# EAGLE design capstone (EAGLE 9.5.2)

## Sheet 1 of 6: Block Diagram

## Sheet 2 of 6: Teensy 3.2 Connection
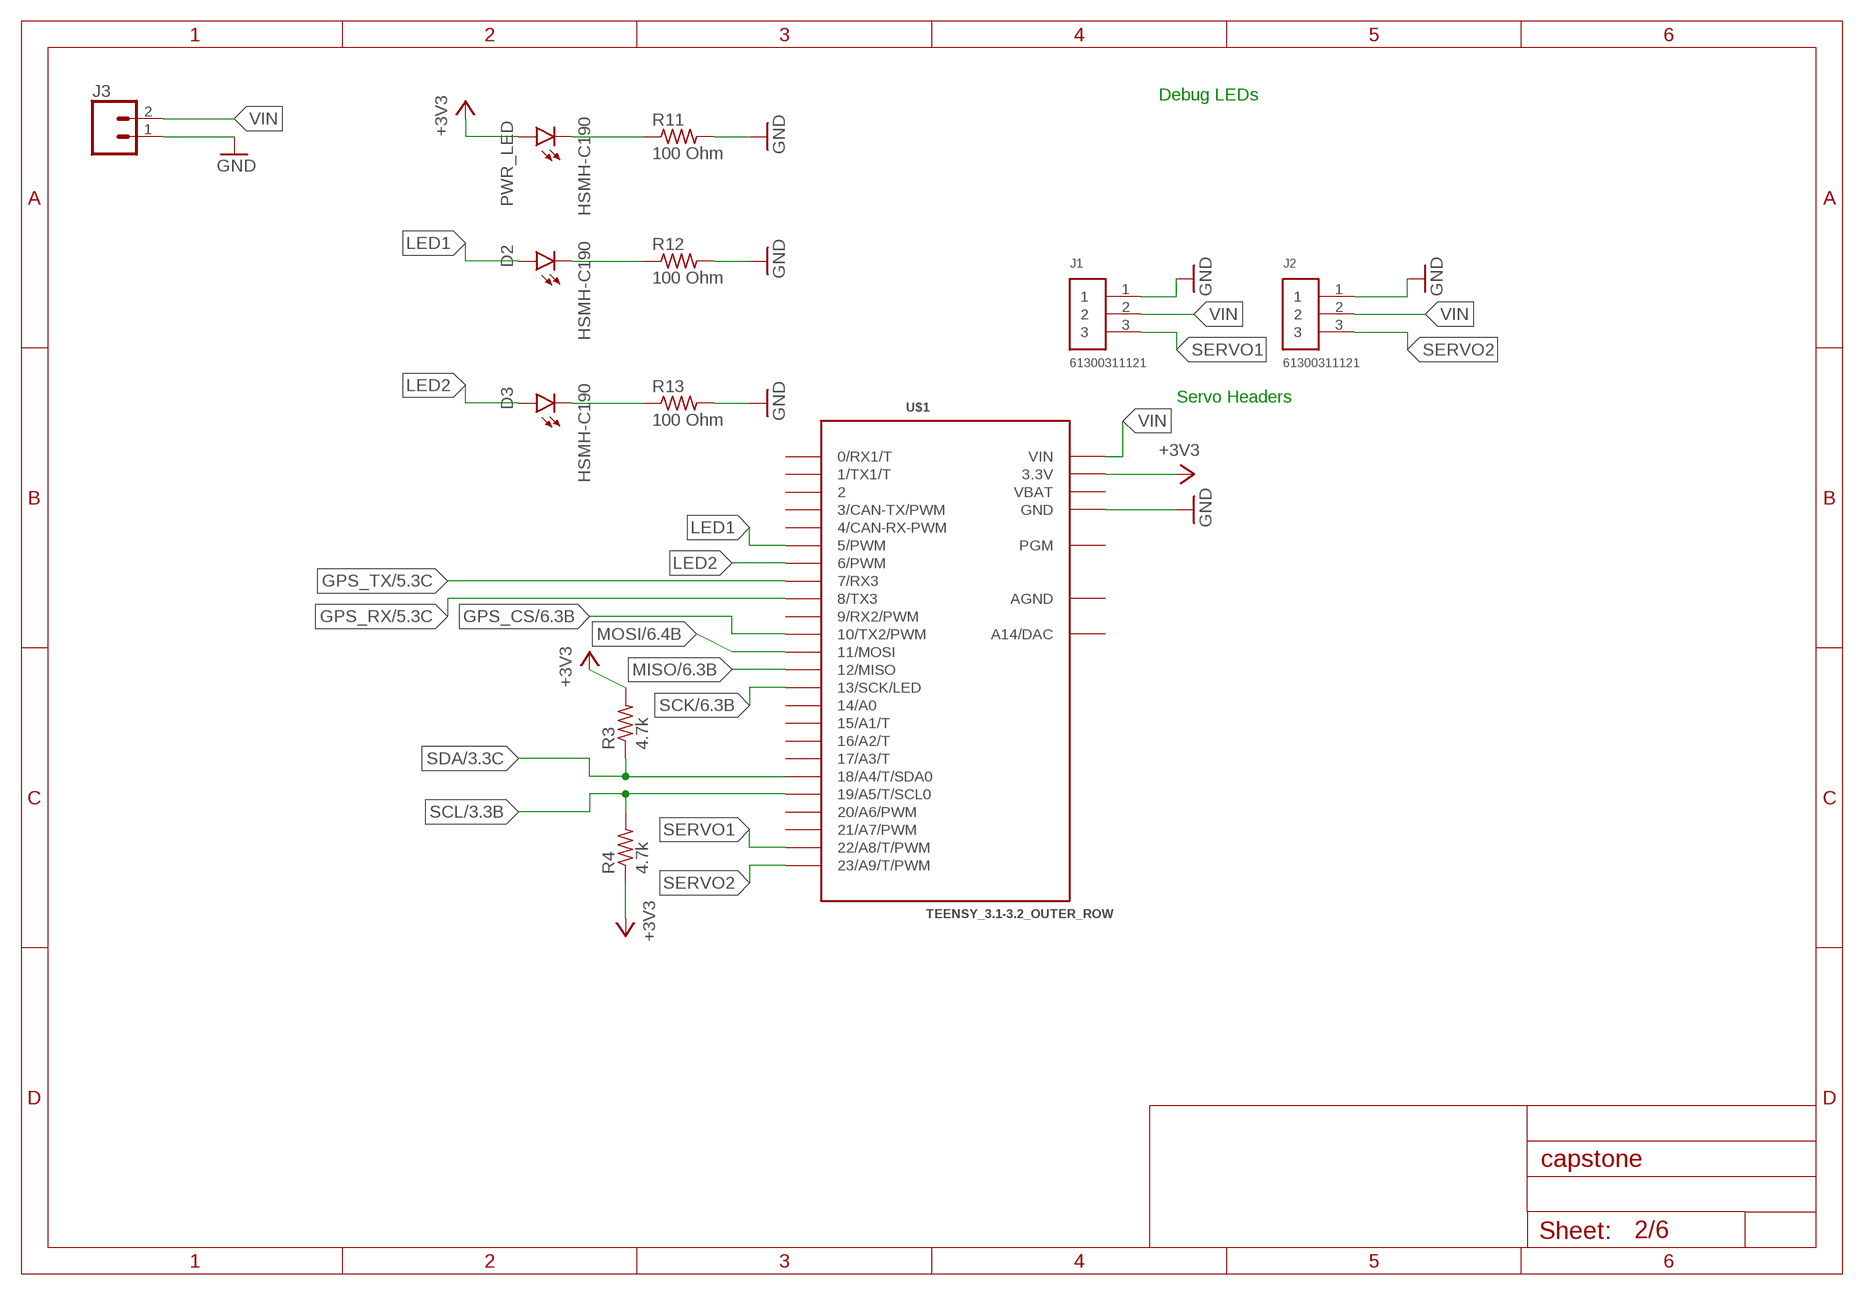
[diagram p0: schematic, sheet 2]

### Parts
D2  HSMH-C190  [LED-0603]
D3  HSMH-C190  [LED-0603]
J1  61300311121  [61300311121]
J2  61300311121  [61300311121]
J3  CONN_02  [1X02]
PWR_LED  HSMH-C190  [LED-0603]
R3  4.7k  R-US_R0603  [R0603]
R4  4.7k  R-US_R0603  [R0603]
R11  100 Ohm  R-US_R0603  [R0603]
R12  100 Ohm  R-US_R0603  [R0603]
R13  100 Ohm  R-US_R0603  [R0603]
U$1  TEENSY_3.1-3.2_OUTER_ROW  [TEENSY_3.0-3.2&LC_OUTER_ROW]

### Nets
+3V3: PWR_LED.A R3.2 R4.1 U$1.3.3V U$1.3.3V1(3.3V) ; also sheet 3,4,5,6
GND: J1.1 J2.1 J3.1 R11.2 R12.2 R13.2 U$1.GND U$1.GND1(GND) ; also sheet 3,4,5,6
GPS_CS: U$1.10(10/TX2/PWM) ; also sheet 6
GPS_RX: U$1.8(8/TX3) ; also sheet 5
GPS_TX: U$1.7(7/RX3) ; also sheet 5
LED1: D2.A U$1.5(5/PWM)
LED2: D3.A U$1.6(6/PWM)
MISO: U$1.12(12/MISO) ; also sheet 6
MOSI: U$1.11(11/MOSI) ; also sheet 6
N$5: PWR_LED.C R11.1
N$6: D2.C R12.1
N$7: D3.C R13.1
SCK: U$1.13(13/SCK/LED) ; also sheet 6
SCL: R4.2 U$1.19/A5(19/A5/T/SCL0) ; also sheet 3,4
SDA: R3.1 U$1.18/A4(18/A4/T/SDA0) ; also sheet 3,4
SERVO1: J1.3 U$1.22/A8(22/A8/T/PWM)
SERVO2: J2.3 U$1.23/A9(23/A9/T/PWM)
VIN: J1.2 J2.2 J3.2 U$1.VIN
Unconnected: U$1.0(0/RX1/T) U$1.1(1/TX1/T) U$1.2 U$1.3(3/CAN-TX/PWM) U$1.4(4/CAN-RX-PWM) U$1.9(9/RX2/PWM) U$1.14/A0 U$1.15/A1(15/A1/T) U$1.16/A2(16/A2/T) U$1.17/A3(17/A3/T) U$1.20/A6(20/A6/PWM) U$1.21/A7(21/A7/PWM) U$1.PGM U$1.RESET/DAC(A14/DAC)

### Notes on the sheet
- Debug LEDs
- Servo Headers

## Sheet 3 of 6: BMP-388 Connection
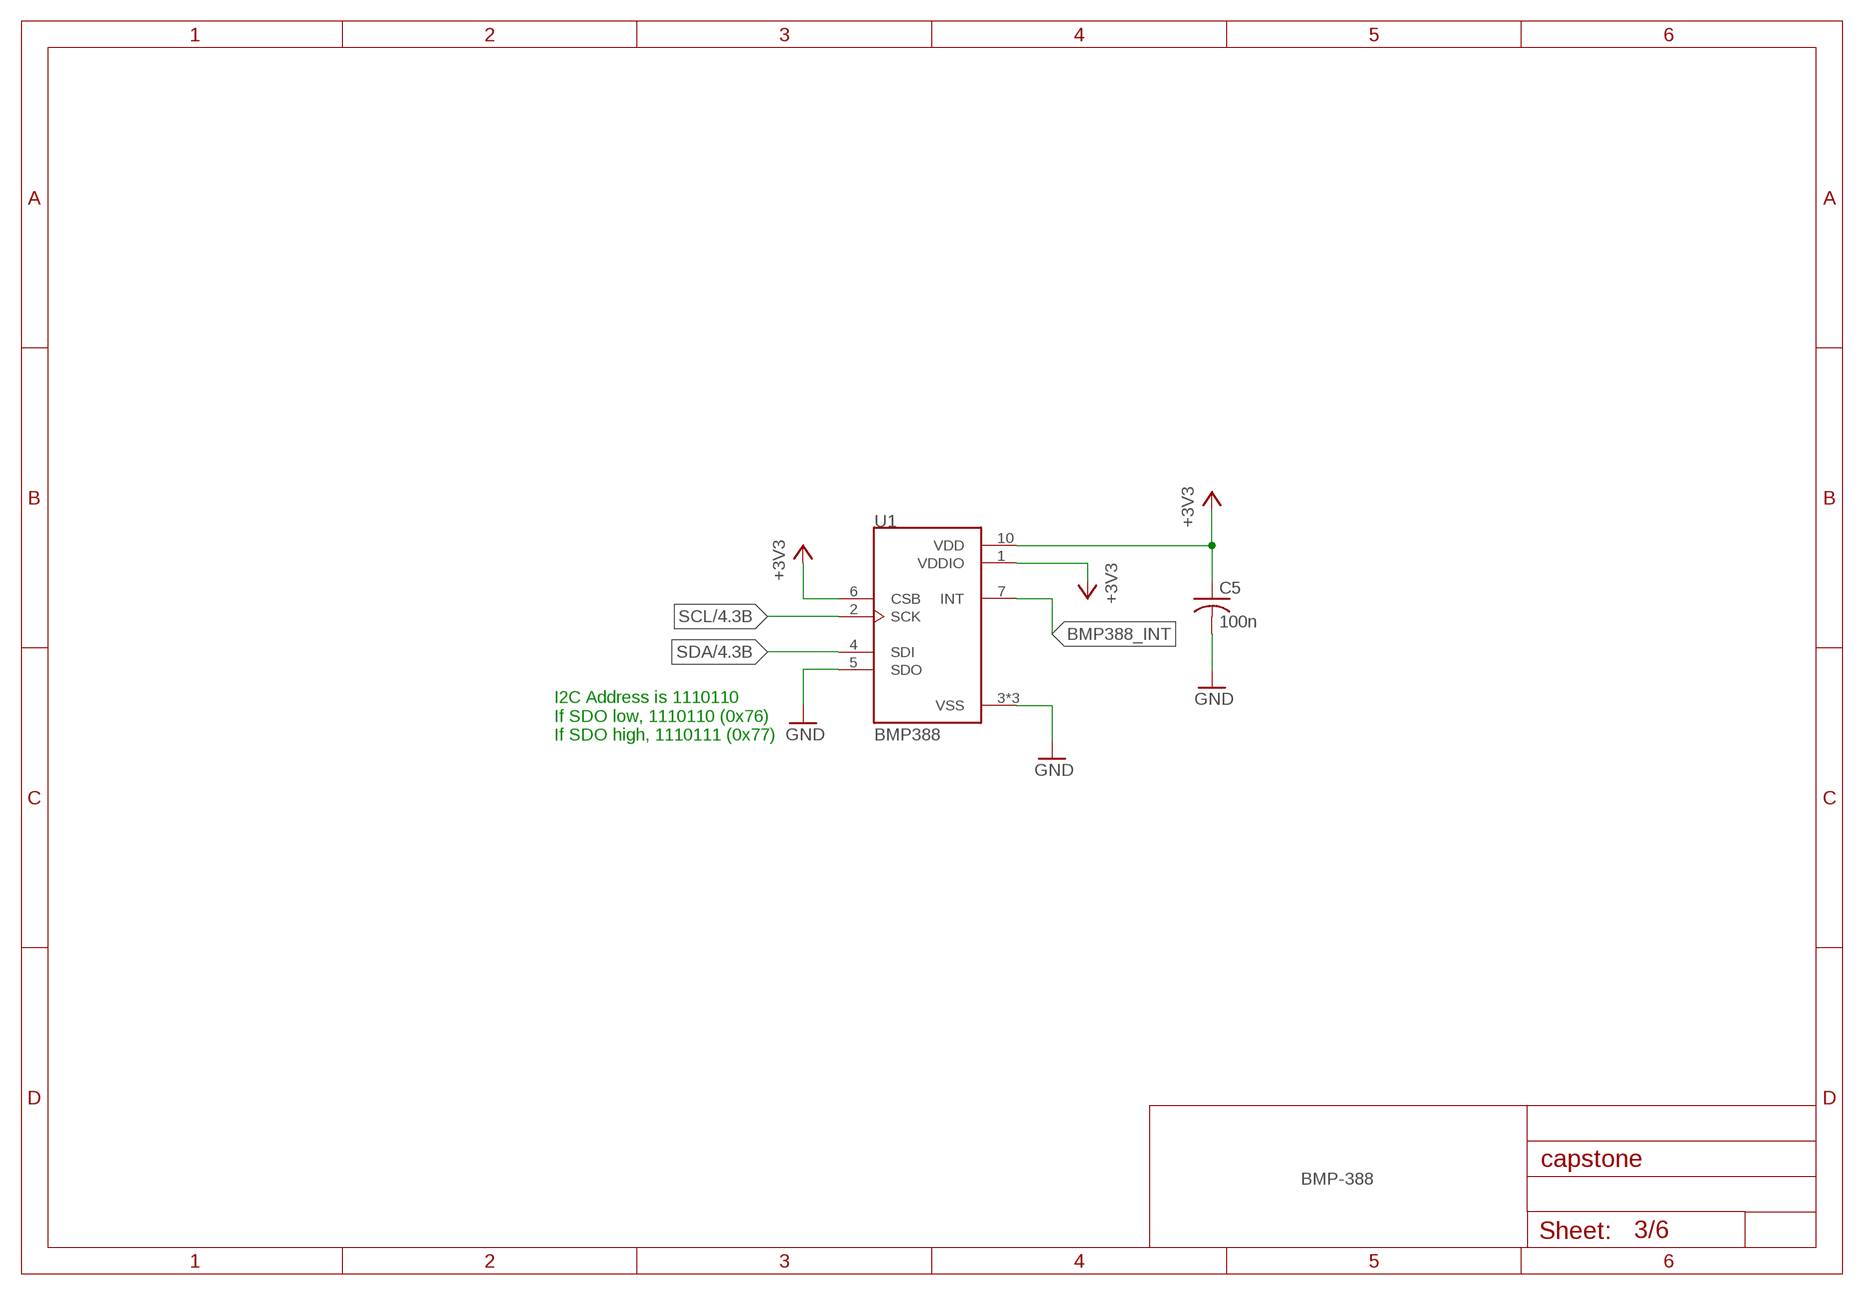
[diagram p1: schematic, sheet 3]

### Parts
C5  100n  C-USC0603  [C0603]
U1  BMP388  [PQFN50P200X200X80-10N]

### Nets
+3V3: C5.1 U1.1(VDDIO) U1.6(CSB) U1.10(VDD) ; also sheet 2,4,5,6
BMP388_INT: U1.7(INT)
GND: C5.2 U1.3(VSS) U1.5(SDO) U1.8(VSS) U1.9(VSS) ; also sheet 2,4,5,6
SCL: U1.2(SCK) ; also sheet 2,4
SDA: U1.4(SDI) ; also sheet 2,4

### Notes on the sheet
- I2C Address is 1110110
  If SDO low, 1110110 (0x76)
  If SDO high, 1110111 (0x77)
- BMP-388

## Sheet 4 of 6: LSM9DS1 Connection
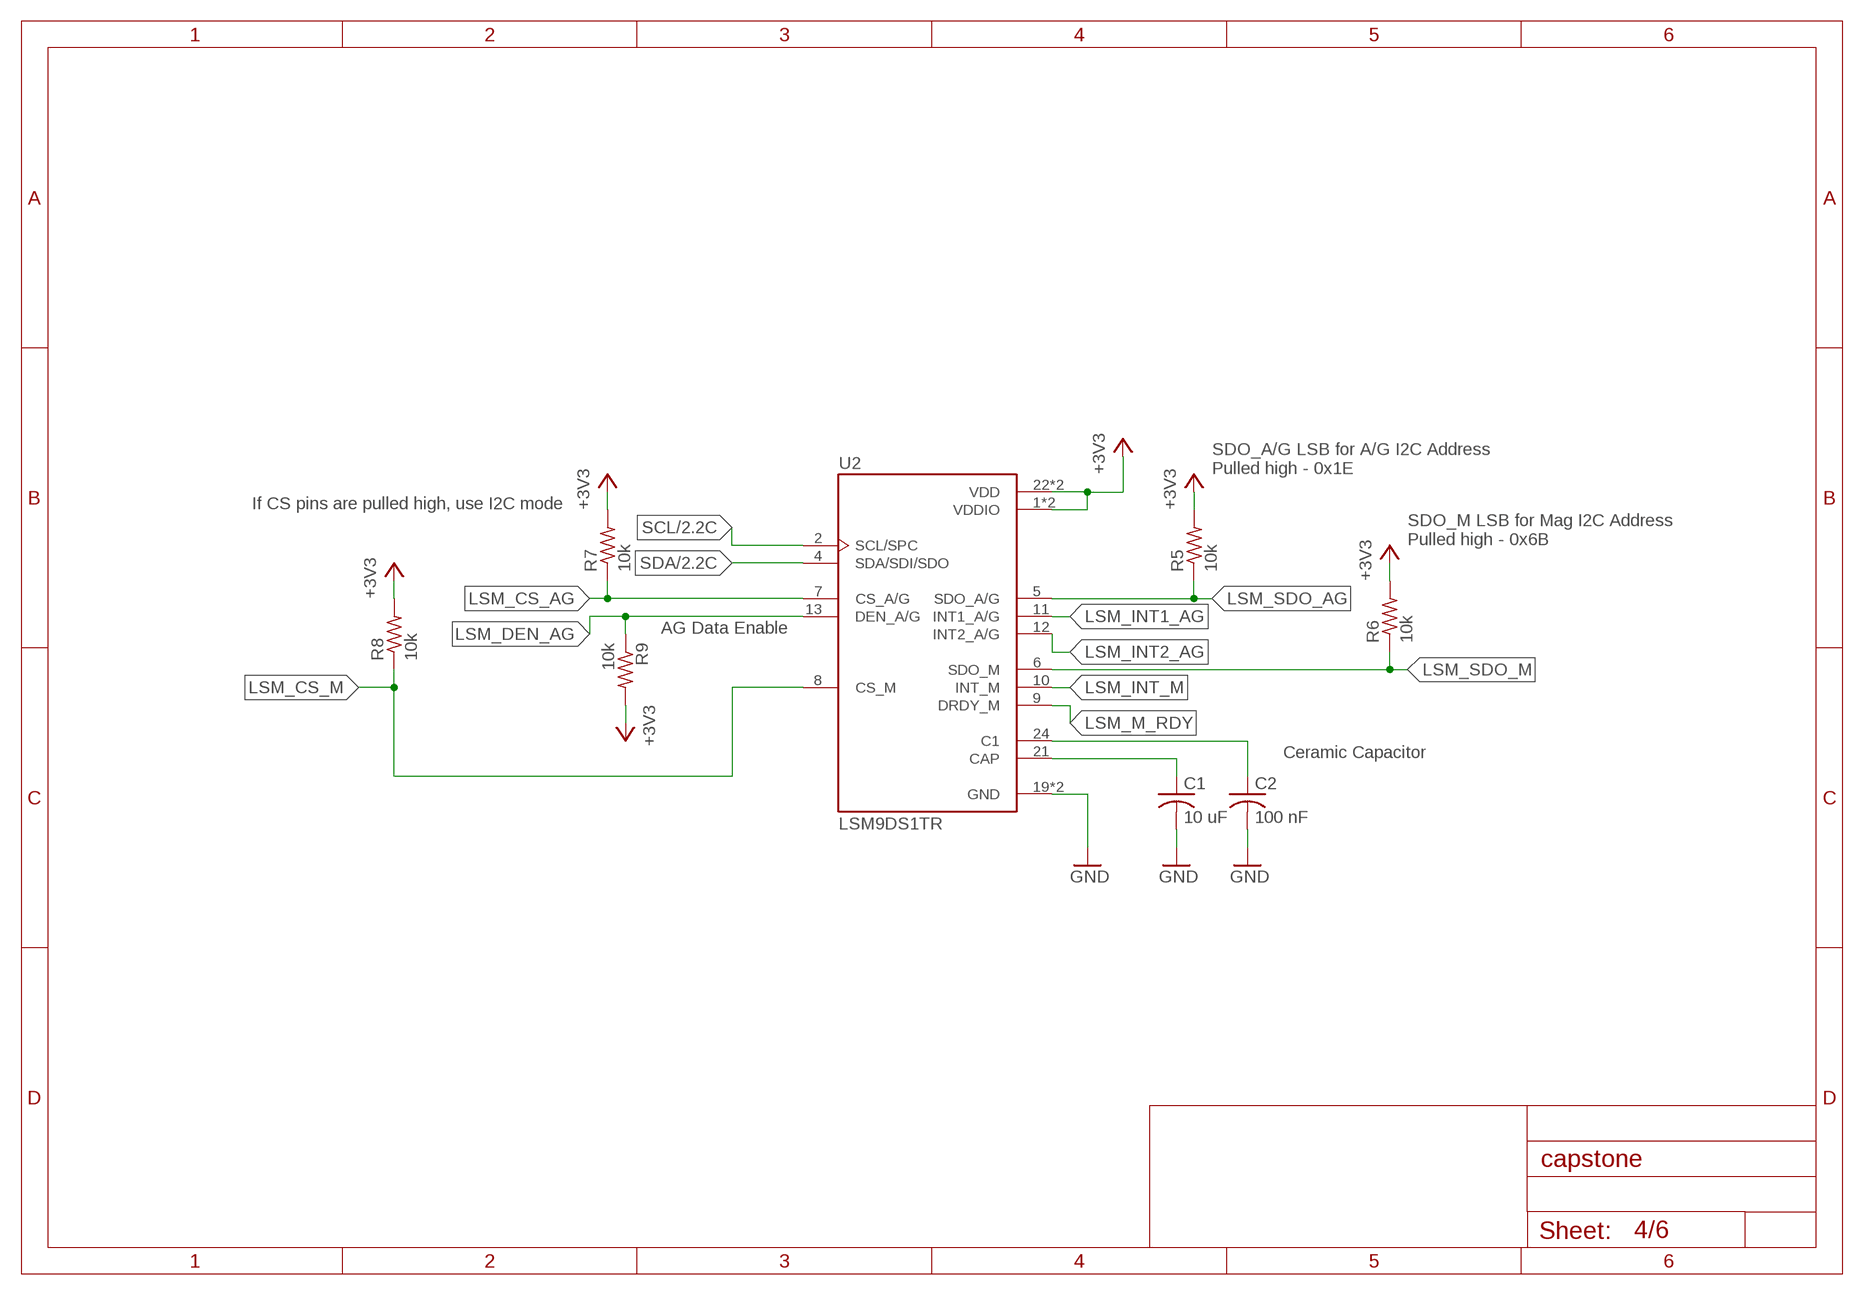
[diagram p2: schematic, sheet 4]

### Parts
C1  10 uF  C-USC0603  [C0603]
C2  100 nF  C-USC0603  [C0603]
R5  10k  R-US_R0603  [R0603]
R6  10k  R-US_R0603  [R0603]
R7  10k  R-US_R0603  [R0603]
R8  10k  R-US_R0603  [R0603]
R9  10k  R-US_R0603  [R0603]
U2  LSM9DS1TR  [PQFN43P300X350X102-24N]

### Nets
+3V3: R5.2 R6.2 R7.2 R8.2 R9.2 U2.1(VDDIO) U2.3(VDDIO) U2.22(VDD) U2.23(VDD) ; also sheet 2,3,5,6
GND: C1.2 C2.2 U2.19(GND) U2.20(GND) ; also sheet 2,3,5,6
LSM_CS_AG: R7.1 U2.7(CS_A/G)
LSM_CS_M: R8.1 U2.8(CS_M)
LSM_DEN_AG: R9.1 U2.13(DEN_A/G)
LSM_INT1_AG: U2.11(INT1_A/G)
LSM_INT2_AG: U2.12(INT2_A/G)
LSM_INT_M: U2.10(INT_M)
LSM_M_RDY: U2.9(DRDY_M)
LSM_SDO_AG: R5.1 U2.5(SDO_A/G)
LSM_SDO_M: R6.1 U2.6(SDO_M)
N$1: C1.1 U2.21(CAP)
N$2: C2.1 U2.24(C1)
SCL: U2.2(SCL/SPC) ; also sheet 2,3
SDA: U2.4(SDA/SDI/SDO) ; also sheet 2,3

### Notes on the sheet
- SDO_A/G LSB for A/G I2C Address
  Pulled high - 0x1E
- If CS pins are pulled high, use I2C mode
- SDO_M LSB for Mag I2C Address
  Pulled high - 0x6B
- AG Data Enable
- Ceramic Capacitor

## Sheet 5 of 6: MTK3399 Connection
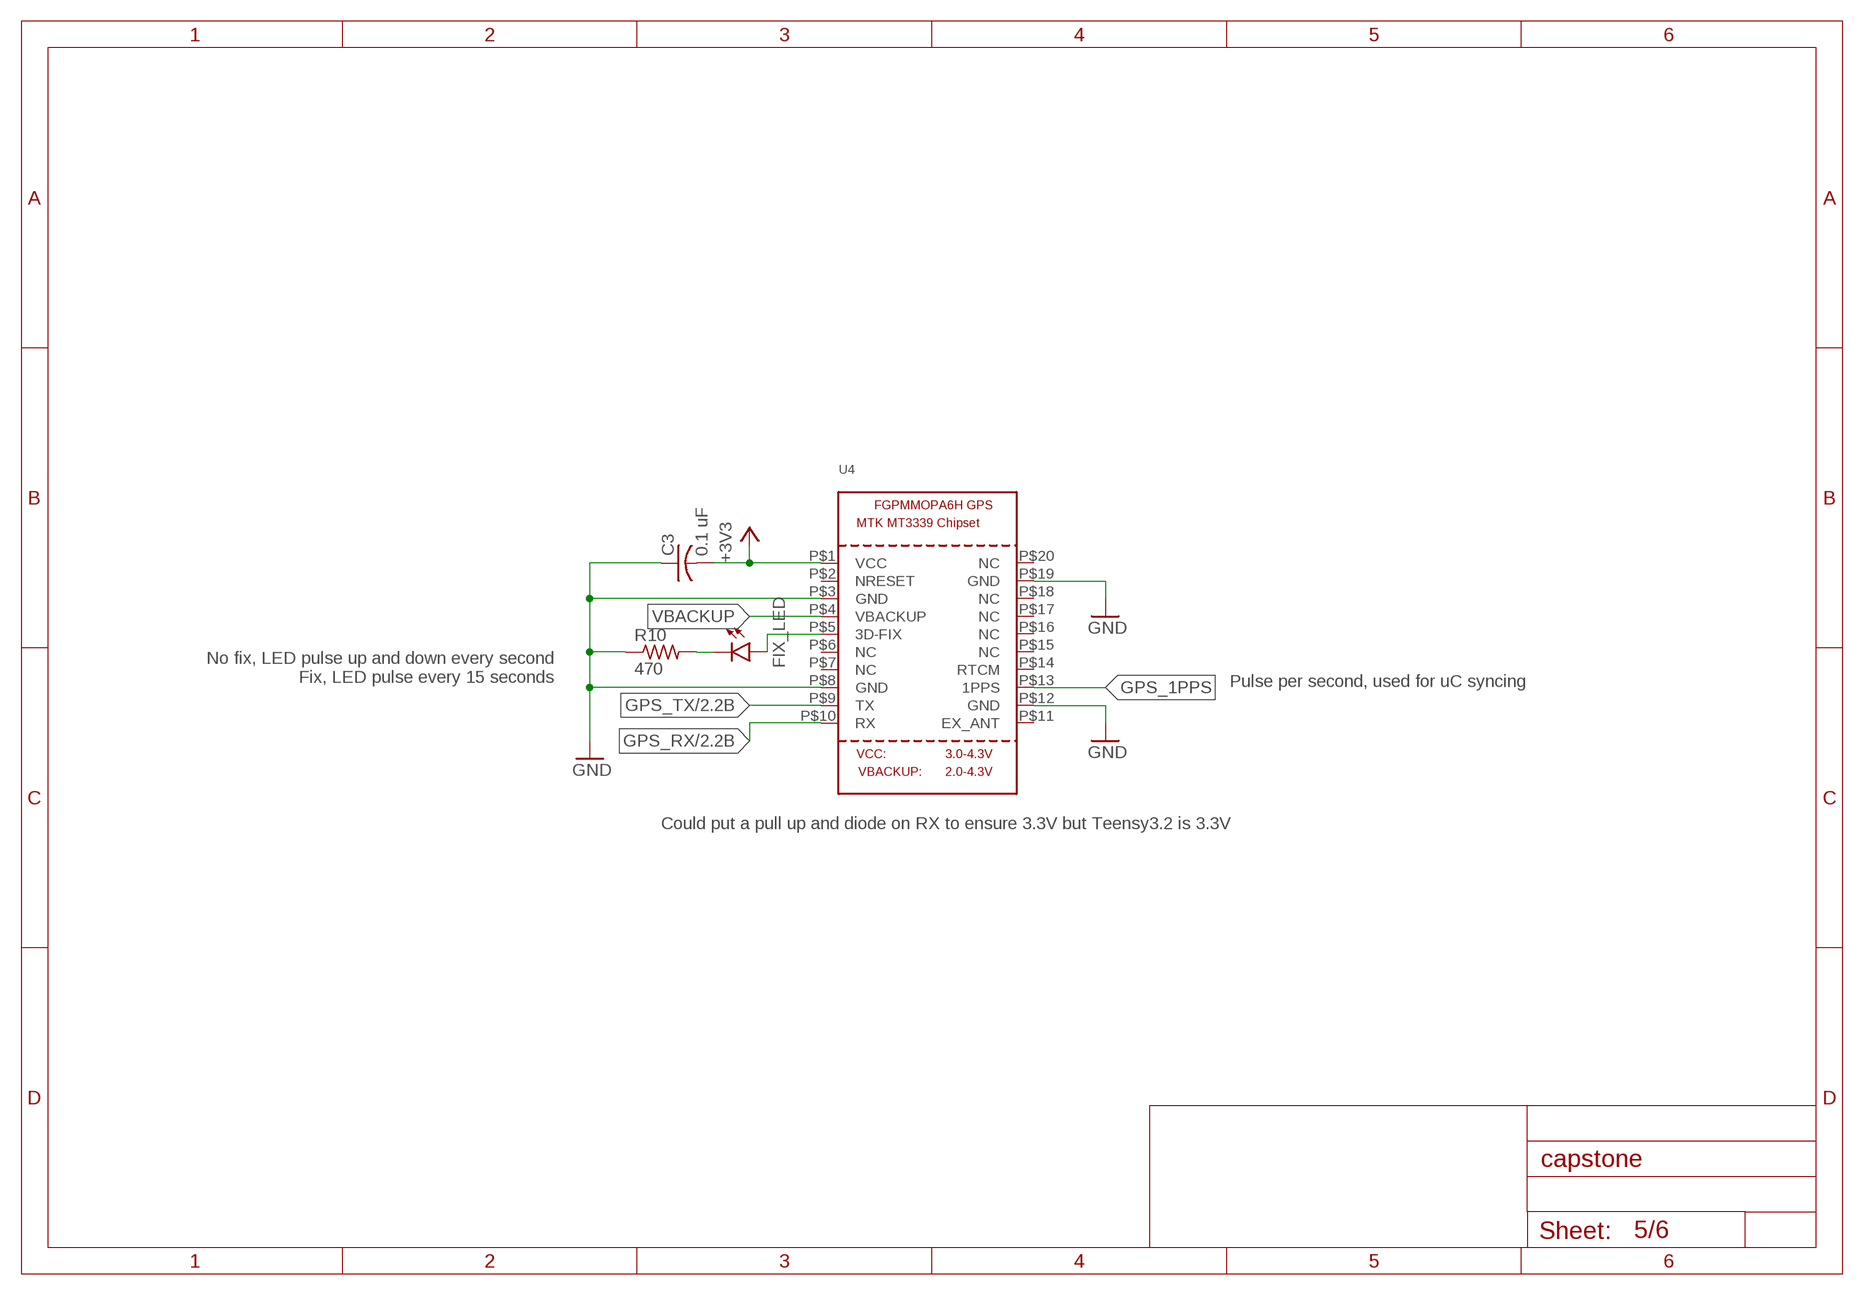
[diagram p3: schematic, sheet 5]

### Parts
C3  0.1 uF  C-USC0603  [C0603]
FIX_LED  HSMH-C190  [LED-0603]
R10  470  R-US_R0603  [R0603]
U4  GPS_FGPMMOPA6H  [FGPMMOPA6H]

### Nets
+3V3: C3.2 U4.P$1(VCC) ; also sheet 2,3,4,6
GND: C3.1 R10.1 U4.P$3(GND) U4.P$8(GND) U4.P$12(GND) U4.P$19(GND) ; also sheet 2,3,4,6
GPS_1PPS: U4.P$13(1PPS)
GPS_RX: U4.P$10(RX) ; also sheet 2
GPS_TX: U4.P$9(TX) ; also sheet 2
N$3: FIX_LED.C R10.2
N$4: FIX_LED.A U4.P$5(3D-FIX)
VBACKUP: U4.P$4(VBACKUP)
Unconnected: U4.P$2(NRESET) U4.P$6(NC) U4.P$7(NC) U4.P$11(EX_ANT) U4.P$14(RTCM) U4.P$15(NC) U4.P$16(NC) U4.P$17(NC) U4.P$18(NC) U4.P$20(NC)

### Notes on the sheet
- No fix, LED pulse up and down every second
  Fix, LED pulse every 15 seconds
- Pulse per second, used for uC syncing
- Could put a pull up and diode on RX to ensure 3.3V but Teensy3.2 is 3.3V

## Sheet 6 of 6: RFM95W Connection
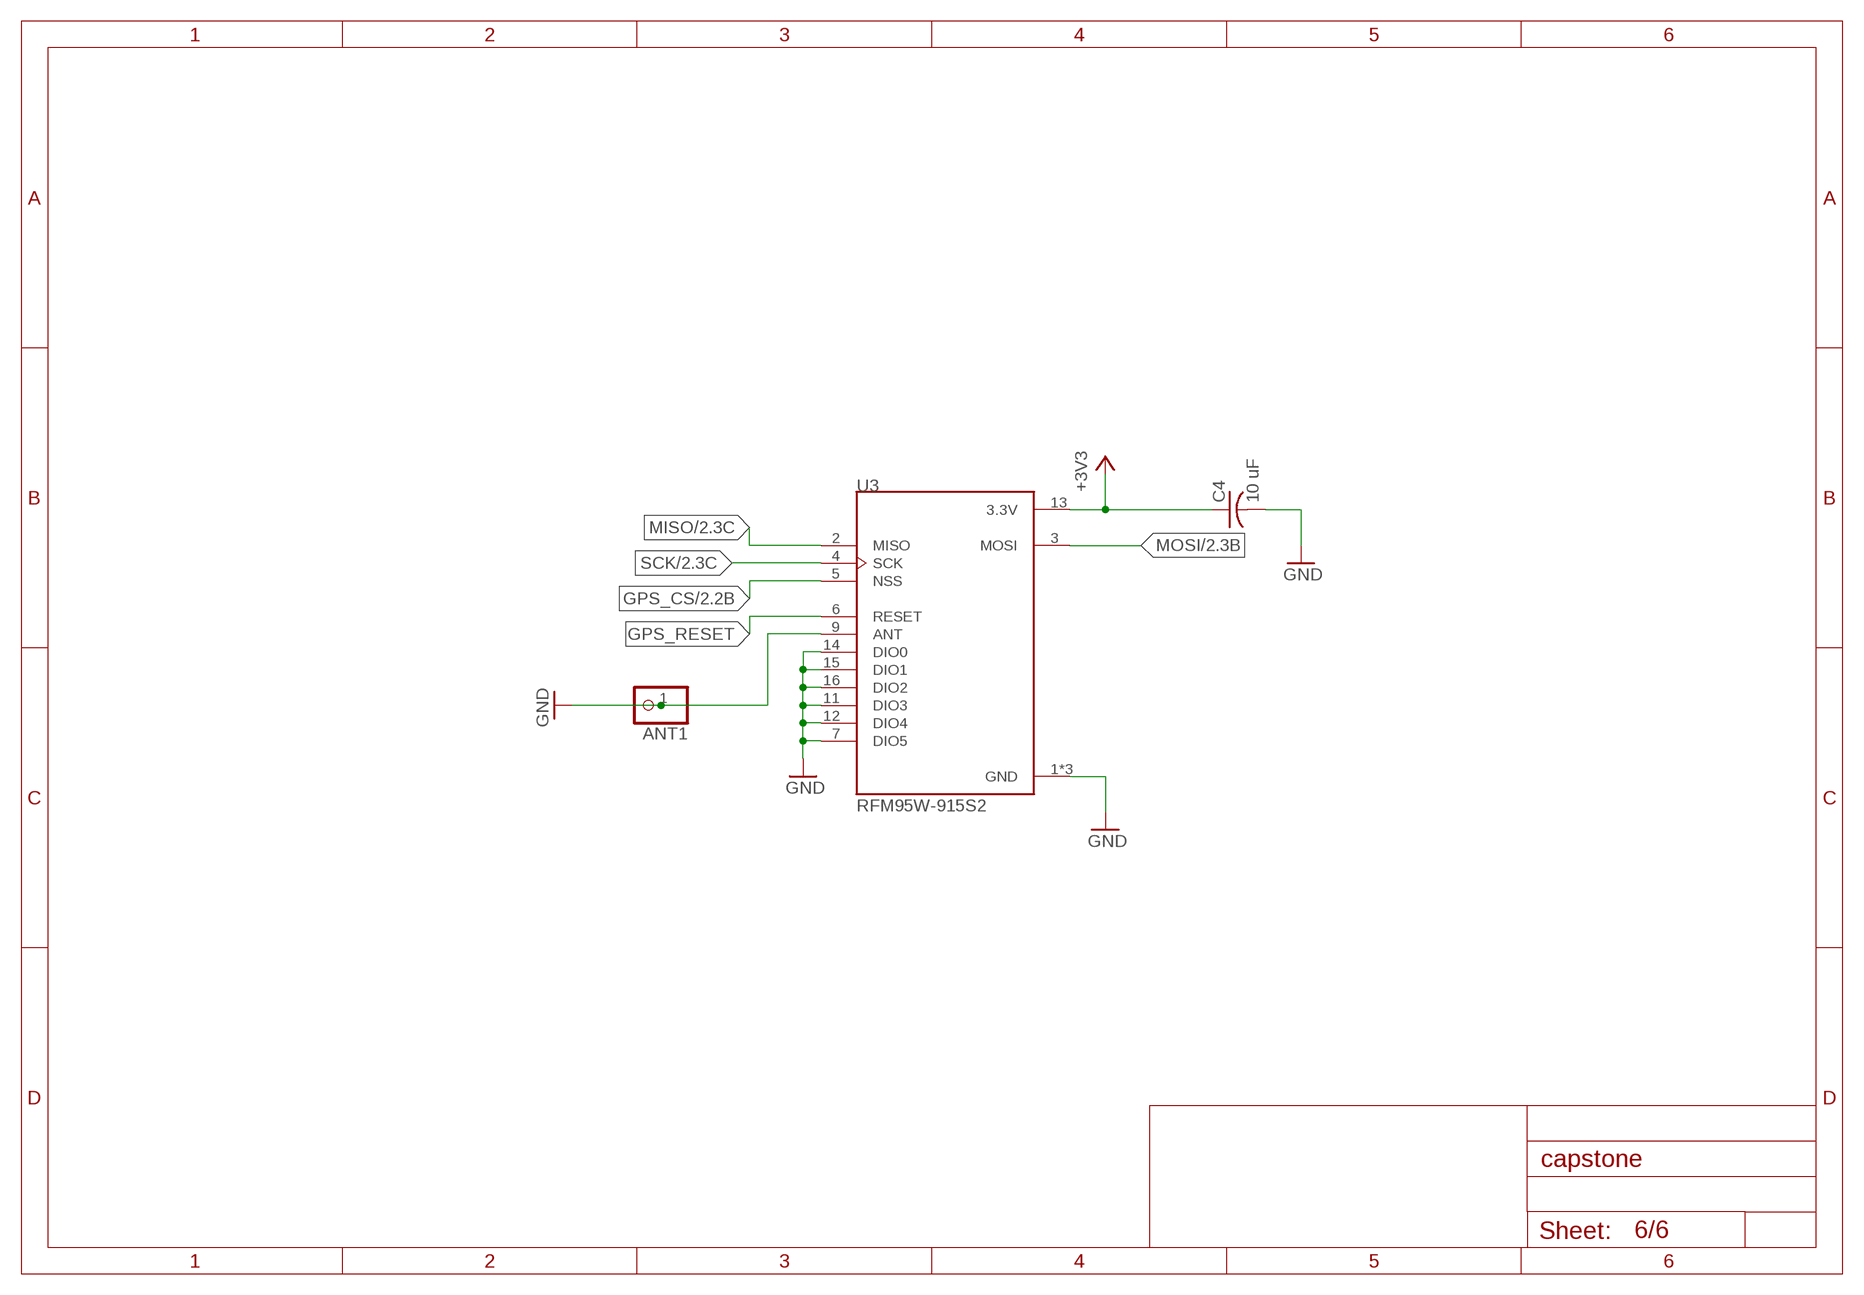
[diagram p4: schematic, sheet 6]

### Parts
ANT1  PINHD-1X1  [1X01]
C4  10 uF  C-USC0603  [C0603]
U3  RFM95W-915S2  [XCVR_RFM95W-915S2]

### Nets
+3V3: C4.1 U3.13(3.3V) ; also sheet 2,3,4,5
GND: ANT1.1 C4.2 U3.1(GND) U3.7(DIO5) U3.8(GND) U3.9(ANT) U3.10(GND) U3.11(DIO3) U3.12(DIO4) U3.14(DIO0) U3.15(DIO1) U3.16(DIO2) ; also sheet 2,3,4,5
GPS_CS: U3.5(NSS) ; also sheet 2
GPS_RESET: U3.6(RESET)
MISO: U3.2(MISO) ; also sheet 2
MOSI: U3.3(MOSI) ; also sheet 2
SCK: U3.4(SCK) ; also sheet 2

## Power pins joined to a net without a drawn wire
AGND: U$1.AGND
VBAT: U$1.VBAT

## Library data of the parts
ANT1 = adafruit:PINHD-1X1: Pin header 1x1 for 0.1" spacing With round pins
C1-C4 = resistor:C-US: CAPACITOR, American symbol
C5 = rcl:C-US: CAPACITOR, American symbol; SPICEPREFIX: C
D2 D3 FIX_LED PWR_LED = LED:HSMH-C190: LED RED DIFFUSED CHIP SMD Manufacturer's datasheet <https://media.digikey.com/pdf/Data%20Sheets/Avago%20PDFs/HSMz-Czzz.pdf>; CREATED_BY: PCBLayout.com; DIGIKEY_PART_NUMBER: 516-1420-1-ND; MANUFACTURER: Broadcom Limited; MPN: HSMH-C190; PACKAGE: 0603
J1 J2 = Headers:61300311121: CONN HEADER VERT 3POS 2.54MM Manufacturer's datasheet <https://katalog.we-online.de/em/datasheet/6130xx11121.pdf>; CREATED_BY: PCBLayout.com; DIGI_KEY_PART_NUMBER: 732-5316-ND; MANUFACTURER: Wurth Electronics Inc.; MPN: 61300311121
J3 = SparkFun-Connectors:CONN_02: Multi connection point. Often used as Generic Header-pin footprint for 0.1 inch spaced/style header connections On any of the 0.1 inch spaced packages, you can populate with these: Break Away Headers - Straight <https://www.sparkfun.com/products/116> (PRT-00116) Break Away Male Headers - Right Angle <https://www.sparkfun.com/products/553> (PRT-00553) Female Headers <https://www.sparkfun.com/products/115> (PRT-00115) Break Away Headers - Machine Pin <https://www.sparkfun.com/products/117> (PRT-00117) Break Away Female Headers - Swiss Machine Pin <https://www.sparkfun.com/products/743> (PRT-00743) For SCREWTERMINALS and SPRING TERMINALS visit here: Screw Terimnals on SparkFun.com <https://www.sparkfun.com/search/results?term=Screw+Terminals> (5mm/3.5mm/2.54mm spacing) This device is also useful as a general connection point to wire up your design to another part of your project. Our various solder wires solder well into these plated through hole pads. Hook-Up Wire - Assortment (Stranded, 22 AWG) <https://www.sparkfun.com/products/11375> (PRT-11375) Hook-Up Wire - Assortment (Solid Core, 22 AWG) <https://www.sparkfun.com/products/11367> (PRT-11367) View the entire wire category on our website here <https://www.sparkfun.com/categories/141> Special notes: Molex polarized connector foot print use with: PRT-08233 with associated crimp pins and housings. 2.54_SCREWTERM for use with PRT-10571. 3.5mm Screw Terminal footprints for PRT-08084 5mm Screw Terminal footprints for use with PRT-08432
R3-R13 = resistor:R-US_: RESISTOR, American symbol
U1 = BMP388:BMP388: P-Sensor SPI I2C 1, 25 Bar SMD; DESCRIPTION: P-Sensor SPI I2C 1, 25 Bar SMD; DIGI-KEY_PART_NUMBER: 828-1079-1-ND; DIGI-KEY_PURCHASE_URL: https://www.digikey.ca/product-detail/en/bosch-sensortec/BMP388/828-1079-1-ND/8322640?utm_source=snapeda&utm_medium=aggregator&utm_campaign=symbol; MF: Bosch Sensortec; MP: BMP388; PACKAGE: WFLGA-10 Bosch Tools
U2 = LSM9DS1TR:LSM9DS1TR: The LSM9DS1 is a system-in-package featuring a 3D digital linear acceleration sensor, a 3D digital angular rate sensor, and a 3D digital magnetic sensor.; DESCRIPTION: LSM9DS1 Series ±2/±4/±8/±16 g 3D Digital Linear Acceleration Sensor - LGA-24; DIGI-KEY_PART_NUMBER: 497-14946-1-ND; DIGI-KEY_PURCHASE_URL: https://www.digikey.ca/product-detail/en/stmicroelectronics/LSM9DS1TR/497-14946-1-ND/4988079?utm_source=snapeda&utm_medium=aggregator&utm_campaign=symbol; MF: STMicroelectronics; MP: LSM9DS1TR; PACKAGE: TFLGA-24 STMicroelectronics
U3 = RFM95W-915S2:RFM95W-915S2: RFM95(W) - Low Power Long Range Transceiver Module V1.0; DESCRIPTION: RFM95W LoRA Transceiver Module 915MHz; DIGI-KEY_PART_NUMBER: RFM95W-915S2-ND; DIGI-KEY_PURCHASE_URL: https://www.digikey.ca/product-detail/en/rf-solutions/RFM95W-915S2/RFM95W-915S2-ND/6564923?utm_source=snapeda&utm_medium=aggregator&utm_campaign=symbol; MF: RF Solutions; MP: RFM95W-915S2; PACKAGE: SMD-16 RF Solutions
U4 = adafruit:GPS_FGPMMOPA6H: GPS Module - MTK MT3339 Chipset, -165dBm sensitivity, 22 channels, 10Hz, auto-select external antenna options
U$1 = Teensy_3_and_LC_Series_Boards_v1.4:TEENSY_3.1-3.2_OUTER_ROW: Footprint for Teensy 3.1 or 3.2 board using all pin connections on the outer perimeter

## Board
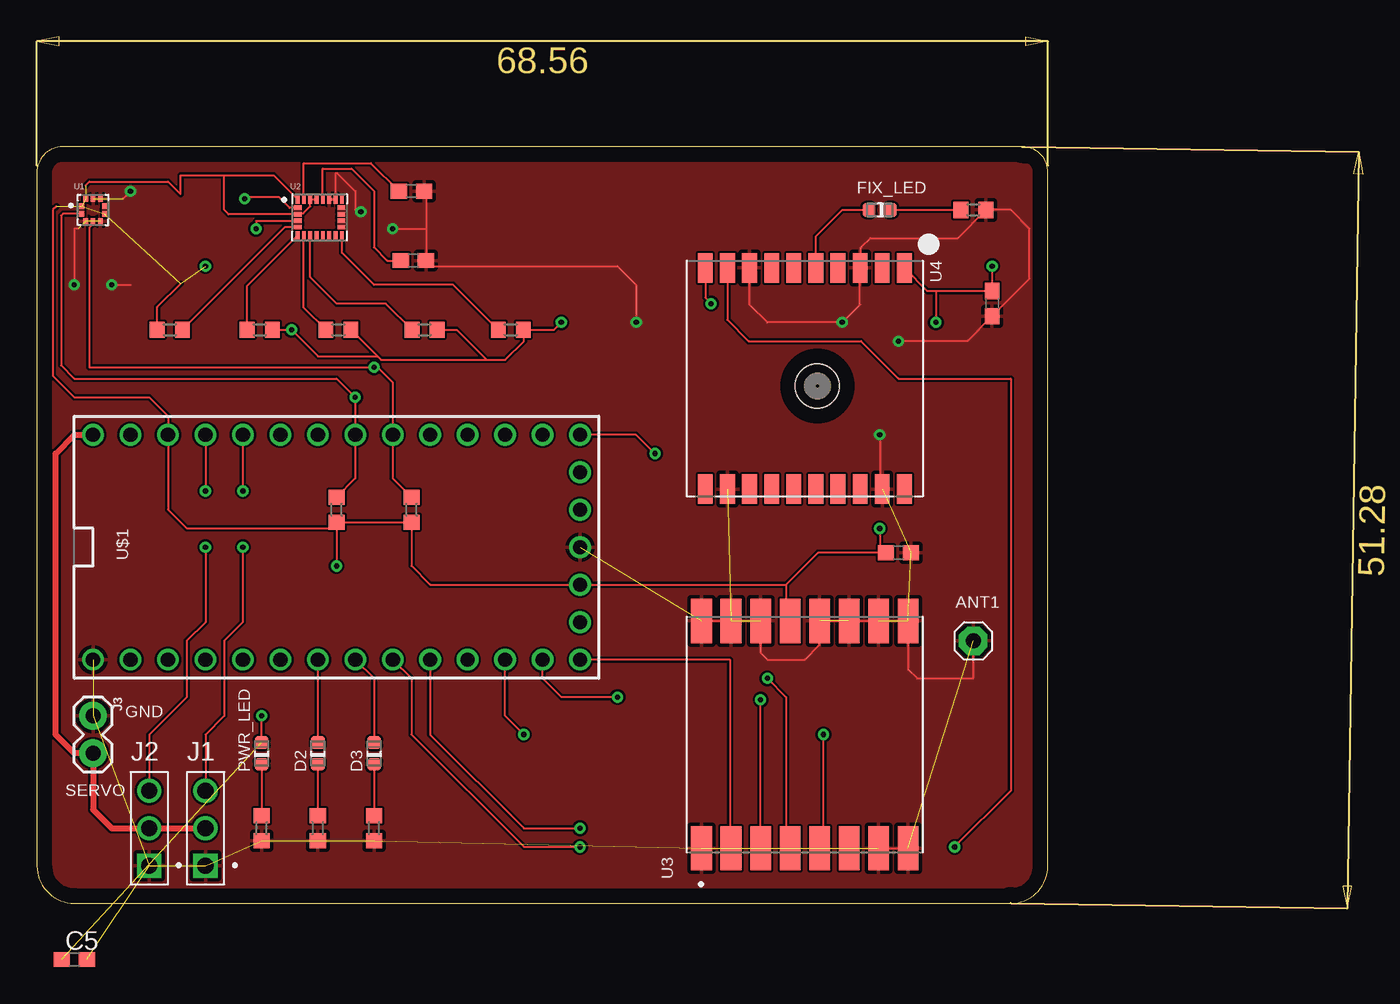
[diagram p5: board, top side]
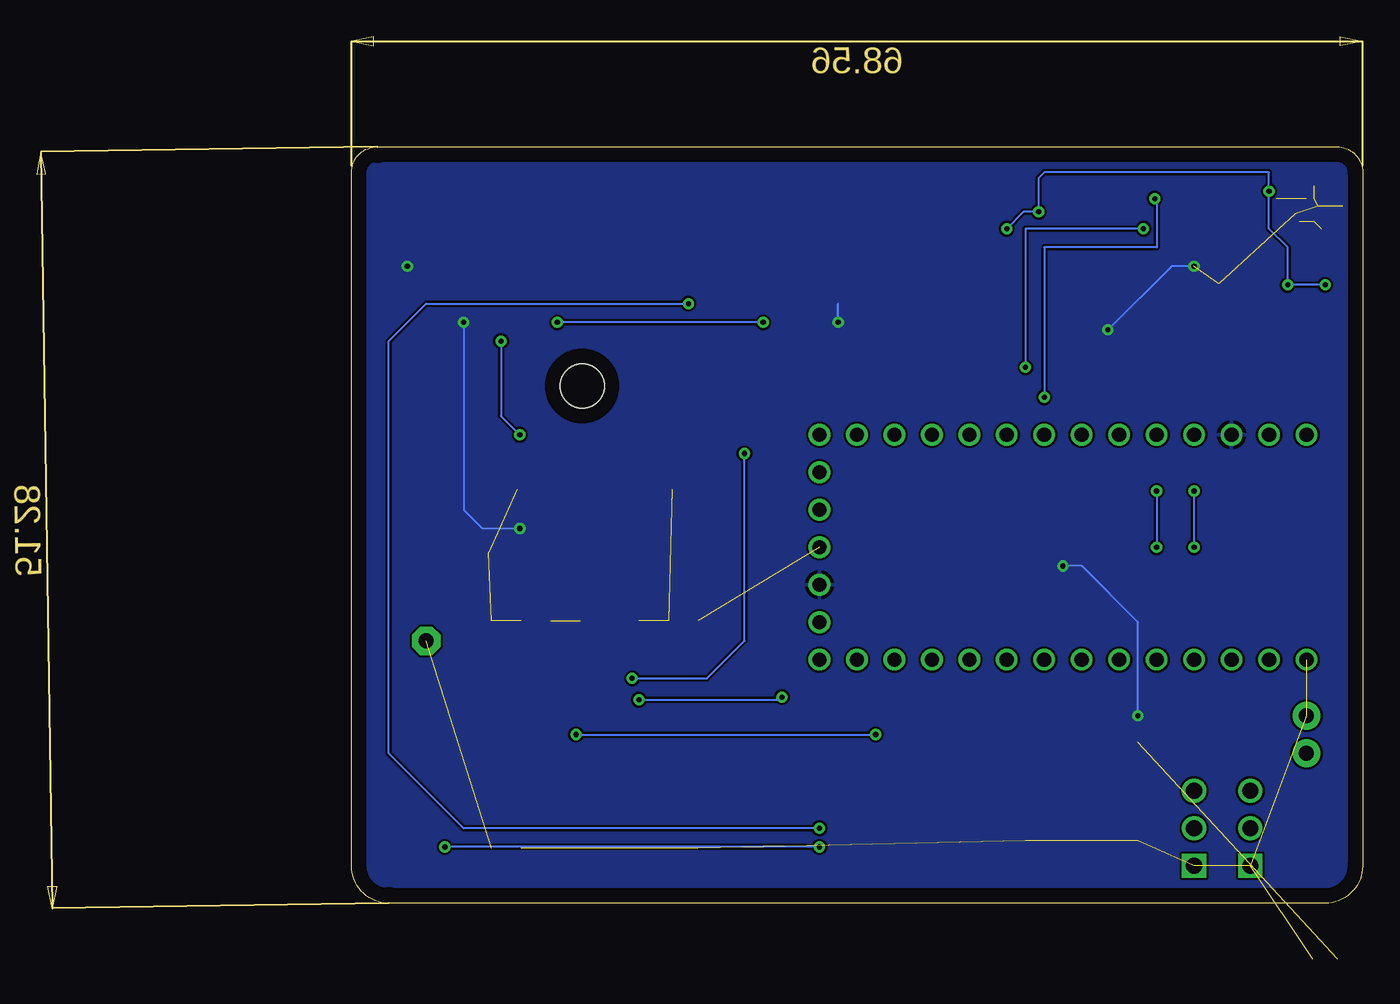
[diagram p6: board, bottom side, seen from below]

Size 68.56 x 51.27 mm. Coordinates in mm from the lower left corner, seen from the top.
Outline: 0,49.53 0,2.54 arc90 2.54,0 66.04,0 arc90 68.56,2.52 68.56,49.53 arc90 66.82,51.27 1.74,51.27 arc90 0,49.53
Copper layers (1*16): Top 0.035mm / dielectric 1.5mm / Bottom 0.035mm
Design rules "default": minimum track width 6mil, minimum drill 0.35mm, track to track 6mil, track to pad 6mil, pad to pad 6mil, via to via 6mil, smd to smd 6mil, copper to edge 40mil, drill to drill 6mil, minimum pad ring 10mil, minimum via ring 8mil, stop-mask expansion 4mil, vias tented up to drill 0mil, thermal gap 10mil

### Footprints (pad centres in the part's own frame; a part is rotated, then mirrored left to right if it is on the bottom)
1X01 = drill 1.016 pad 1.93 octagon: 1 0,0
C0603 = smd 1.1 x 1: 1 -0.85,0; 2 0.85,0
LED-0603 = smd 0.86 x 0.93: A 0.735,0; C -0.735,0
61300311121 = drill 1.1 square: 1 -2.54,0 | drill 1.1: 2 0,0; 3 2.54,0
1X02 = drill 1.016 pad 1.88: 1 0,0; 2 2.54,0
R0603 = smd 1 x 1.1: 1 -0.85,0; 2 0.85,0
PQFN50P200X200X80-10N = smd 0.35 x 0.38: 1 -0.765,0.25; 2 -0.765,-0.25; 3 -0.5,-0.765; 4 0,-0.765; 5 0.5,-0.765; 6 0.765,-0.25; 7 0.765,0.25; 8 0.5,0.765; 9 0,0.765; 10 -0.5,0.765
PQFN43P300X350X102-24N = smd 0.28 x 0.53: 1 -1.505,1.22; 6 -1.505,-1.22; 7 -1.075,-1.22; 8 -0.645,-1.22; 9 -0.215,-1.22; 10 0.215,-1.22; 11 0.645,-1.22; 12 1.075,-1.22; 13 1.505,-1.22; 18 1.505,1.22; 19 1.075,1.22; 20 0.645,1.22; 21 0.215,1.22; 22 -0.215,1.22; 23 -0.645,1.22; 24 -1.075,1.22 | smd 0.53 x 0.28: 2 -1.47,0.645; 3 -1.47,0.215; 4 -1.47,-0.215; 5 -1.47,-0.645; 14 1.47,-0.645; 15 1.47,-0.215; 16 1.47,0.215; 17 1.47,0.645
XCVR_RFM95W-915S2 = smd 3 x 1.4: 1 -7.7,7; 2 -7.7,5; 3 -7.7,3; 4 -7.7,1; 5 -7.7,-1; 6 -7.7,-3; 7 -7.7,-5; 8 -7.7,-7; 9 7.7,-7; 10 7.7,-5; 11 7.7,-3; 12 7.7,-1; 13 7.7,1; 14 7.7,3; 15 7.7,5; 16 7.7,7
FGPMMOPA6H = smd 2 x 1: P$1 -7.5,6.75; P$2 -7.5,5.25; P$3 -7.5,3.75; P$4 -7.5,2.25; P$5 -7.5,0.75; P$6 -7.5,-0.75; P$7 -7.5,-2.25; P$8 -7.5,-3.75; P$9 -7.5,-5.25; P$10 -7.5,-6.75; P$11 7.5,-6.75; P$12 7.5,-5.25; P$13 7.5,-3.75; P$14 7.5,-2.25; P$15 7.5,-0.75; P$16 7.5,0.75; P$17 7.5,2.25; P$18 7.5,3.75; P$19 7.5,5.25; P$20 7.5,6.75 | hole 3: 0.5,0.85
TEENSY_3.0-3.2&LC_OUTER_ROW = drill 0.965: 0 -7.62,13.97; 1 -7.62,11.43; 2 -7.62,8.89; 3 -7.62,6.35; 3.3V 7.62,11.43; 3.3V1 -2.54,-16.51; 4 -7.62,3.81; 5 -7.62,1.27; 6 -7.62,-1.27; 7 -7.62,-3.81; 8 -7.62,-6.35; 9 -7.62,-8.89; 10 -7.62,-11.43; 11 -7.62,-13.97; 12 -7.62,-16.51; 13 7.62,-16.51; 14/A0 7.62,-13.97; 15/A1 7.62,-11.43; 16/A2 7.62,-8.89; 17/A3 7.62,-6.35; 18/A4 7.62,-3.81; 19/A5 7.62,-1.27; 20/A6 7.62,1.27; 21/A7 7.62,3.81; 22/A8 7.62,6.35; 23/A9 7.62,8.89; AGND 7.62,13.97; GND -7.62,16.51; GND1 0,-16.51; PGM 2.54,-16.51; RESET/DAC 5.08,-16.51; VBAT -5.08,-16.51; VIN 7.62,16.51

### Placement (x,y rotation side)
ANT1  63.5,17.78 0 top
C1  25.53,43.56 0 top
C2  25.4,48.26 0 top
C3  64.77,40.64 90 top
C4  58.42,23.75 0 top
C5  2.54,-3.81 0 top  (outside the outline)
D2  19.05,10.16 90 top
D3  22.86,10.16 90 top
FIX_LED  57.15,46.99 180 top
J1  11.43,5.08 90 top
J2  7.62,5.08 90 top
J3  3.81,12.7 270 top
PWR_LED  15.24,10.16 90 top
R3  25.4,26.67 270 top
R4  20.32,26.67 90 top
R5  9.02,38.86 180 top
R6  15.11,38.86 0 top
R7  20.45,38.86 0 top
R8  26.29,38.86 0 top
R9  32.13,38.86 0 top
R10  63.5,46.99 180 top
R11  15.24,5.08 270 top
R12  19.05,5.08 270 top
R13  22.86,5.08 270 top
U1  3.81,46.99 0 top
U2  19.18,46.48 0 top
U3  52.07,11.43 90 top
U4  52.07,35.56 270 top
U$1  20.32,24.13 90 top

### Tracks (layer width: path | path; a pad name or v marks a point on that pad's centre or on a via)
+3V3  (via drill 0.35)  (7 unrouted)
  Top 0.152: 1.34,47.24 1.09,46.99 1.09,35.74 2.54,34.29 7.62,34.29 8.89,33.02 U$1.3.3V 8.89,26.67 10.16,25.4 19.9,25.4 R4.1 | 3.31,48.63 3.3,48.64 3.3,48.65 3.56,48.91 8.89,48.91 9.74,48.06 9.74,49.33 12.7,49.33 | R6.2 v17.27,38.86 19.07,37.06 23.09,37.06 | R5.2 8.17,40.42 9.74,42 | 12.7,49.33 16.05,49.33 U2.1 | R4.1 R3.2 25.4,22.86 26.67,21.59 U$1.3.3V1 50.8,21.59 | 60.96,41.49 C3.2 v64.77,43.18 | 60.96,41.49 60.39,41.49 U4.P$1 | U3.13 50.8,19.4 50.8,21.59 | R4.1 v20.32,22.86 | PWR_LED.A v15.24,12.7 | 60.96,41.49 v60.96,39.37 | v57.15,25.4 57.15,24.17 C4.1 52.96,23.75 50.8,21.59 | R8.2 28.45,38.86 30.48,36.83 | 30.48,36.83 31.75,36.83 33.02,38.1 33.02,38.9 R9.2 35.05,38.86 v35.56,39.37 | R7.2 23.09,37.06 | 23.09,37.06 23.33,36.83 30.48,36.83 | 12.7,49.33 12.7,46.99 12.99,46.7 U2.3 17.77,46.76 18.06,46.76 18.54,47.24 18.54,47.7 U2.22 U2.23
  Bottom 0.152: v15.24,12.7 15.24,19.05 19.05,22.86 v20.32,22.86 | v60.96,39.37 60.96,26.67 59.69,25.4 v57.15,25.4 | v35.56,39.37 35.56,40.64 | v17.27,38.86 12.95,43.18 v11.43,43.18
  pour Bottom: 0,53.34 0,0 68.58,0 68.58,53.34
GND  (via drill 0.35)  (21 unrouted)
  Top 0.152: U2.20 U2.19 20.25,49.46 20.27,49.48 20.37,49.48 21.59,48.26 21.59,46.99 21.72,46.86 v21.97,46.86 | U3.7 U3.8 | U3.16 U3.14 49.07,16.97 49.53,16.51 52.07,16.51 53.07,17.51 U3.12 U3.9 59.07,15.86 59.69,15.24 63.5,15.24 ANT1.1 | 2.81,45.72 2.54,45.72 v2.54,41.91 | v5.08,41.91 6.35,41.91 | v6.35,48.26 5.84,47.76 | C2.2 26.38,48.13 26.38,45.72 | 26.38,45.72 C1.2 26.76,43.18 39.37,43.18 40.64,41.91 v40.64,39.37 | v24.13,45.72 26.38,45.72 | v58.42,38.1 63.08,38.1 C3.1 67.31,42.33 67.31,45.72 66.04,46.99 R10.1 62.45,45.09 56.52,45.09 55.88,44.45 55.88,43.12 U4.P$3 55.82,40.58 v54.61,39.37 49.53,39.37 48.32,40.58 U4.P$8 | v57.15,31.75 57.15,28.23 U4.P$19
  Bottom 0.152: v2.54,41.91 v5.08,41.91 5.08,44.45 6.35,45.72 v6.35,48.26 6.35,49.53 21.59,49.53 21.97,49.15 v21.97,46.86 22.99,46.86 v24.13,45.72 | v58.42,38.1 58.42,33.02 v57.15,31.75 | v40.64,39.37 v54.61,39.37
  pour Top: 0,50.8 0,0 68.58,0 68.58,50.8
GPS_CS  (via drill 0.35)
  Top 0.152: U3.5 53.34,3.73 v53.34,11.43 | v33.02,11.43 31.75,12.7 U$1.10
  Bottom 0.152: v53.34,11.43 v33.02,11.43
GPS_RX  (via drill 0.35)
  Top 0.152: U$1.8 26.67,11.43 33.02,5.08 v36.83,5.08 | v45.72,40.64 45.32,41.04 U4.P$10
  Bottom 0.152: v36.83,5.08 60.96,5.08 66.04,10.16 66.04,38.1 63.5,40.64 v45.72,40.64
GPS_TX  (via drill 0.35)
  Top 0.152: U$1.7 25.4,15.24 25.4,11.43 33.02,3.81 v36.83,3.81 | v62.23,3.81 66.04,7.62 66.04,35.56 58.42,35.56 55.88,38.1 48.26,38.1 46.82,39.54 U4.P$9
  Bottom 0.152: v36.83,3.81 v62.23,3.81
LED1
  Top 0.152: U$1.5 D2.A
LED2
  Top 0.152: U$1.6 22.86,15.24 D3.A
LSM_CS_AG
  Top 0.152: R7.1 18.1,40.36 U2.7
LSM_CS_M
  Top 0.152: R8.1 23.66,40.64 20.32,40.64 18.53,42.43 U2.8
LSM_DEN_AG
  Top 0.152: R9.1 28.23,41.91 22.86,41.91 20.68,44.09 U2.13
LSM_SDO_AG
  Top 0.152: R5.1 16.84,45.84 U2.5
LSM_SDO_M
  Top 0.152: R6.1 14.26,41.85 U2.6
MISO
  Top 0.152: U3.2 46.99,3.81 46.99,16.51 U$1.12
MOSI  (via drill 0.35)
  Top 0.152: U3.3 v49.07,13.79 | v39.37,13.97 35.56,13.97 34.29,15.24 U$1.11
  Bottom 0.152: v49.07,13.79 39.55,13.79 v39.37,13.97
N$1
  Top 0.152: U2.21 19.39,49.78 21.34,49.78 22.86,48.26 22.86,44.45 23.75,43.56 C1.1
N$2
  Top 0.152: U2.24 18.1,50.16 22.64,50.16 C2.1
N$3
  Top 0.152: FIX_LED.C R10.2
N$4
  Top 0.152: FIX_LED.A 54.61,46.99 52.82,45.2 U4.P$5
N$5
  Top 0.152: PWR_LED.C R11.1
N$6
  Top 0.152: D2.C R12.1
N$7
  Top 0.152: D3.C R13.1
SCK  (via drill 0.35)
  Top 0.152: v49.53,15.24 50.8,13.97 50.8,4 U3.4 | v41.91,30.48 40.64,31.75 U$1.13
  Bottom 0.152: v49.53,15.24 44.45,15.24 41.91,17.78 v41.91,30.48
SCL  (via drill 0.35)
  Top 0.152: U1.2 1.78,46.74 1.65,46.61 1.65,36.45 2.54,35.56 20.32,35.56 v21.59,34.29 U$1.19/A5 21.59,28.79 R4.2 | U2.2 17.14,47.13 16.38,47.88 14.22,47.88 v14.1,47.75
  Bottom 0.152: v14.1,47.75 13.97,47.62 13.97,44.45 21.59,44.45 v21.59,34.29
SDA  (via drill 0.35)
  Top 0.152: U1.4 3.71,46.13 3.71,45.95 3.56,45.79 3.56,36.32 v22.86,36.32 23.11,36.32 24.13,35.31 U$1.18/A4 24.13,28.79 R3.1 | U2.4 17.67,46.23 14.86,46.23 v14.86,45.72
  Bottom 0.152: v14.86,45.72 22.86,45.72 v22.86,36.32
SERVO1  (via drill 0.35)
  Top 0.152: v13.97,24.13 13.97,19.05 12.7,17.78 12.7,12.7 11.43,11.43 J1.3 | U$1.22/A8 v13.97,27.94
  Bottom 0.152: v13.97,27.94 v13.97,24.13
SERVO2  (via drill 0.35)
  Top 0.152: v11.43,24.13 11.43,19.05 10.16,17.78 10.16,13.97 7.62,11.43 J2.3 | U$1.23/A9 v11.43,27.94
  Bottom 0.152: v11.43,27.94 v11.43,24.13
VIN
  Top 0.406: J1.2 J2.2 5.08,5.08 3.81,6.35 J3.2 2.54,10.16 1.27,11.43 1.27,30.48 2.54,31.75 U$1.VIN

### Text on the board
tNames: GND | SERVO